# Altium schematic sheet Sheet1.SchDoc
size A; SheetNumber: 1; SheetTotal: 1
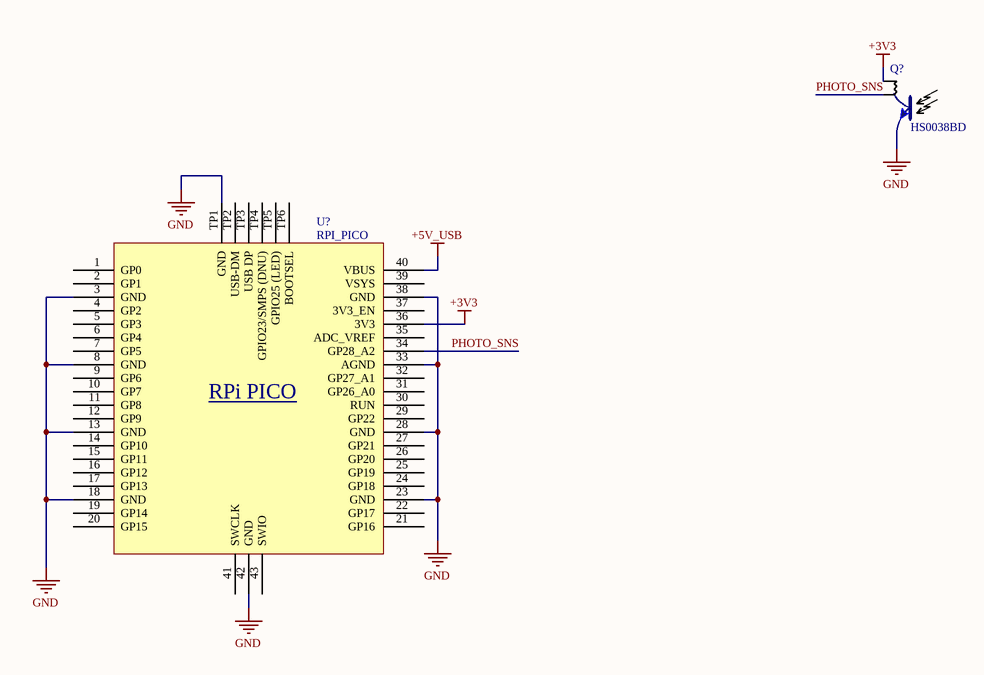
[diagram p0: Sheet1.SchDoc]

## Parts
Q?  HS0038BD  [TO-92A]
U?  RPI_PICO  [RPI_PICO_SMT]

## Nets
+3V3: Q?.3(collector) U?.36(3V3)
+5V_USB: U?.40(VBUS)
GND: Q?.2(emitter) U?.3(GND) U?.8(GND) U?.13(GND) U?.18(GND) U?.23(GND) U?.28(GND) U?.33(AGND) U?.38(GND) U?.42(GND) U?.TP1(GND)
PHOTO_SNS: Q?.1 U?.34(GP28_A2)

Not connected (* = marked no-connect by the designer): U? 1(GP0) 2(GP1) 4(GP2) 5(GP3) 6(GP4) 7(GP5) 9(GP6) 10(GP7) 11(GP8) 12(GP9) 14(GP10) 15(GP11) 16(GP12) 17(GP13) 19(GP14) 20(GP15) 21(GP16) 22(GP17) 24(GP18) 25(GP19) 26(GP20) 27(GP21) 29(GP22) 30(RUN) 31(GP26_A0) 32(GP27_A1) 35(ADC_VREF) 37(3V3_EN) 39(VSYS) 41(SWCLK) 43(SWIO) TP2(USB-DM) TP3(USB_DP) TP4(GPIO23/SMPS_(DNU)) TP5(GPIO25_(LED)) TP6(BOOTSEL)

## Notes on the sheet
- (in symbol RPI_PICO_SMT) RPi PICO

## Library data of the parts
Q? = HS0038BD: Transistor  NPN Phototransistor    TO-92A; Manufacturer: Vishay; Value: HS38BD; CPE-PN: HS0038BD; Type: NPN Phototransistor; ManufacturerPN: HS0038BD; DataSheetLink: http://irsensor.wizecode.com/sensor.pdf
U? = RPI_PICO_SMT: IC RP2040   RPI_PICO_SMT; Manufacturer: Raspberry Pi; CPE-PN: RPI_PICO_SMT; Value: RP2040; Type: Microcontroller; ManufacturerPN: RP2040; DataSheetLink: https://datasheets.raspberrypi.com/pico/pico-datasheet.pdf